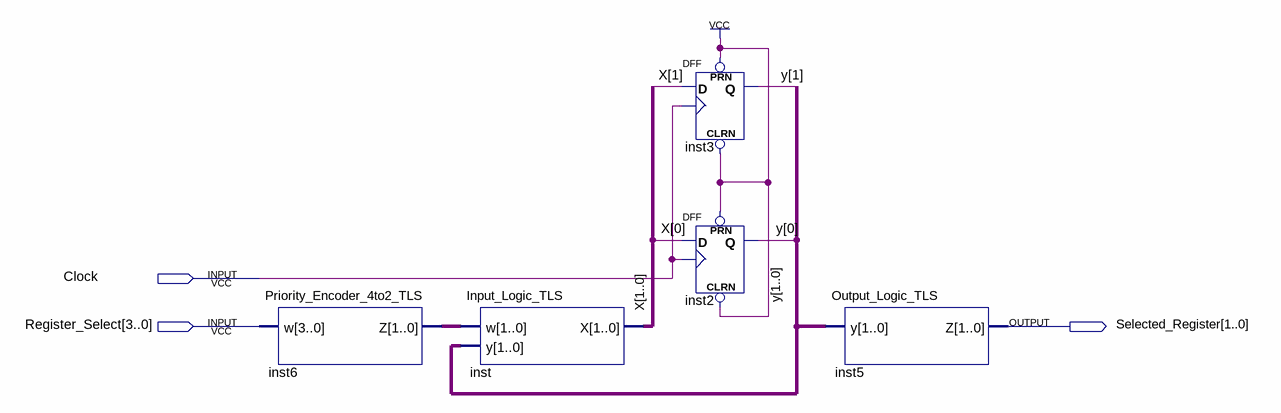
[diagram p0: schematic sheet]
// Quartus schematic TLS_Machine.bdf as structural Verilog: 5 symbols, 3 pins
module TLS_Machine (
  input  Clock,
  input  [3:0] Register_Select,
  output [1:0] Selected_Register
);

  wire [1:0] inst6_z, X, y;

  Priority_Encoder_4to2_TLS inst6 (.w(Register_Select), .Z(inst6_z));
  Input_Logic_TLS inst (.w(inst6_z), .y(y), .X(X));
  DFF inst3 (.CLRN(1'b1), .CLK(Clock), .D(X[1]), .PRN(1'b1), .Q(y[1]));
  DFF inst2 (.CLRN(1'b1), .CLK(Clock), .D(X[0]), .PRN(1'b1), .Q(y[0]));
  Output_Logic_TLS inst5 (.y(y), .Z(Selected_Register));
endmodule
